# EAGLE design main-board (EAGLE 6.6.0)
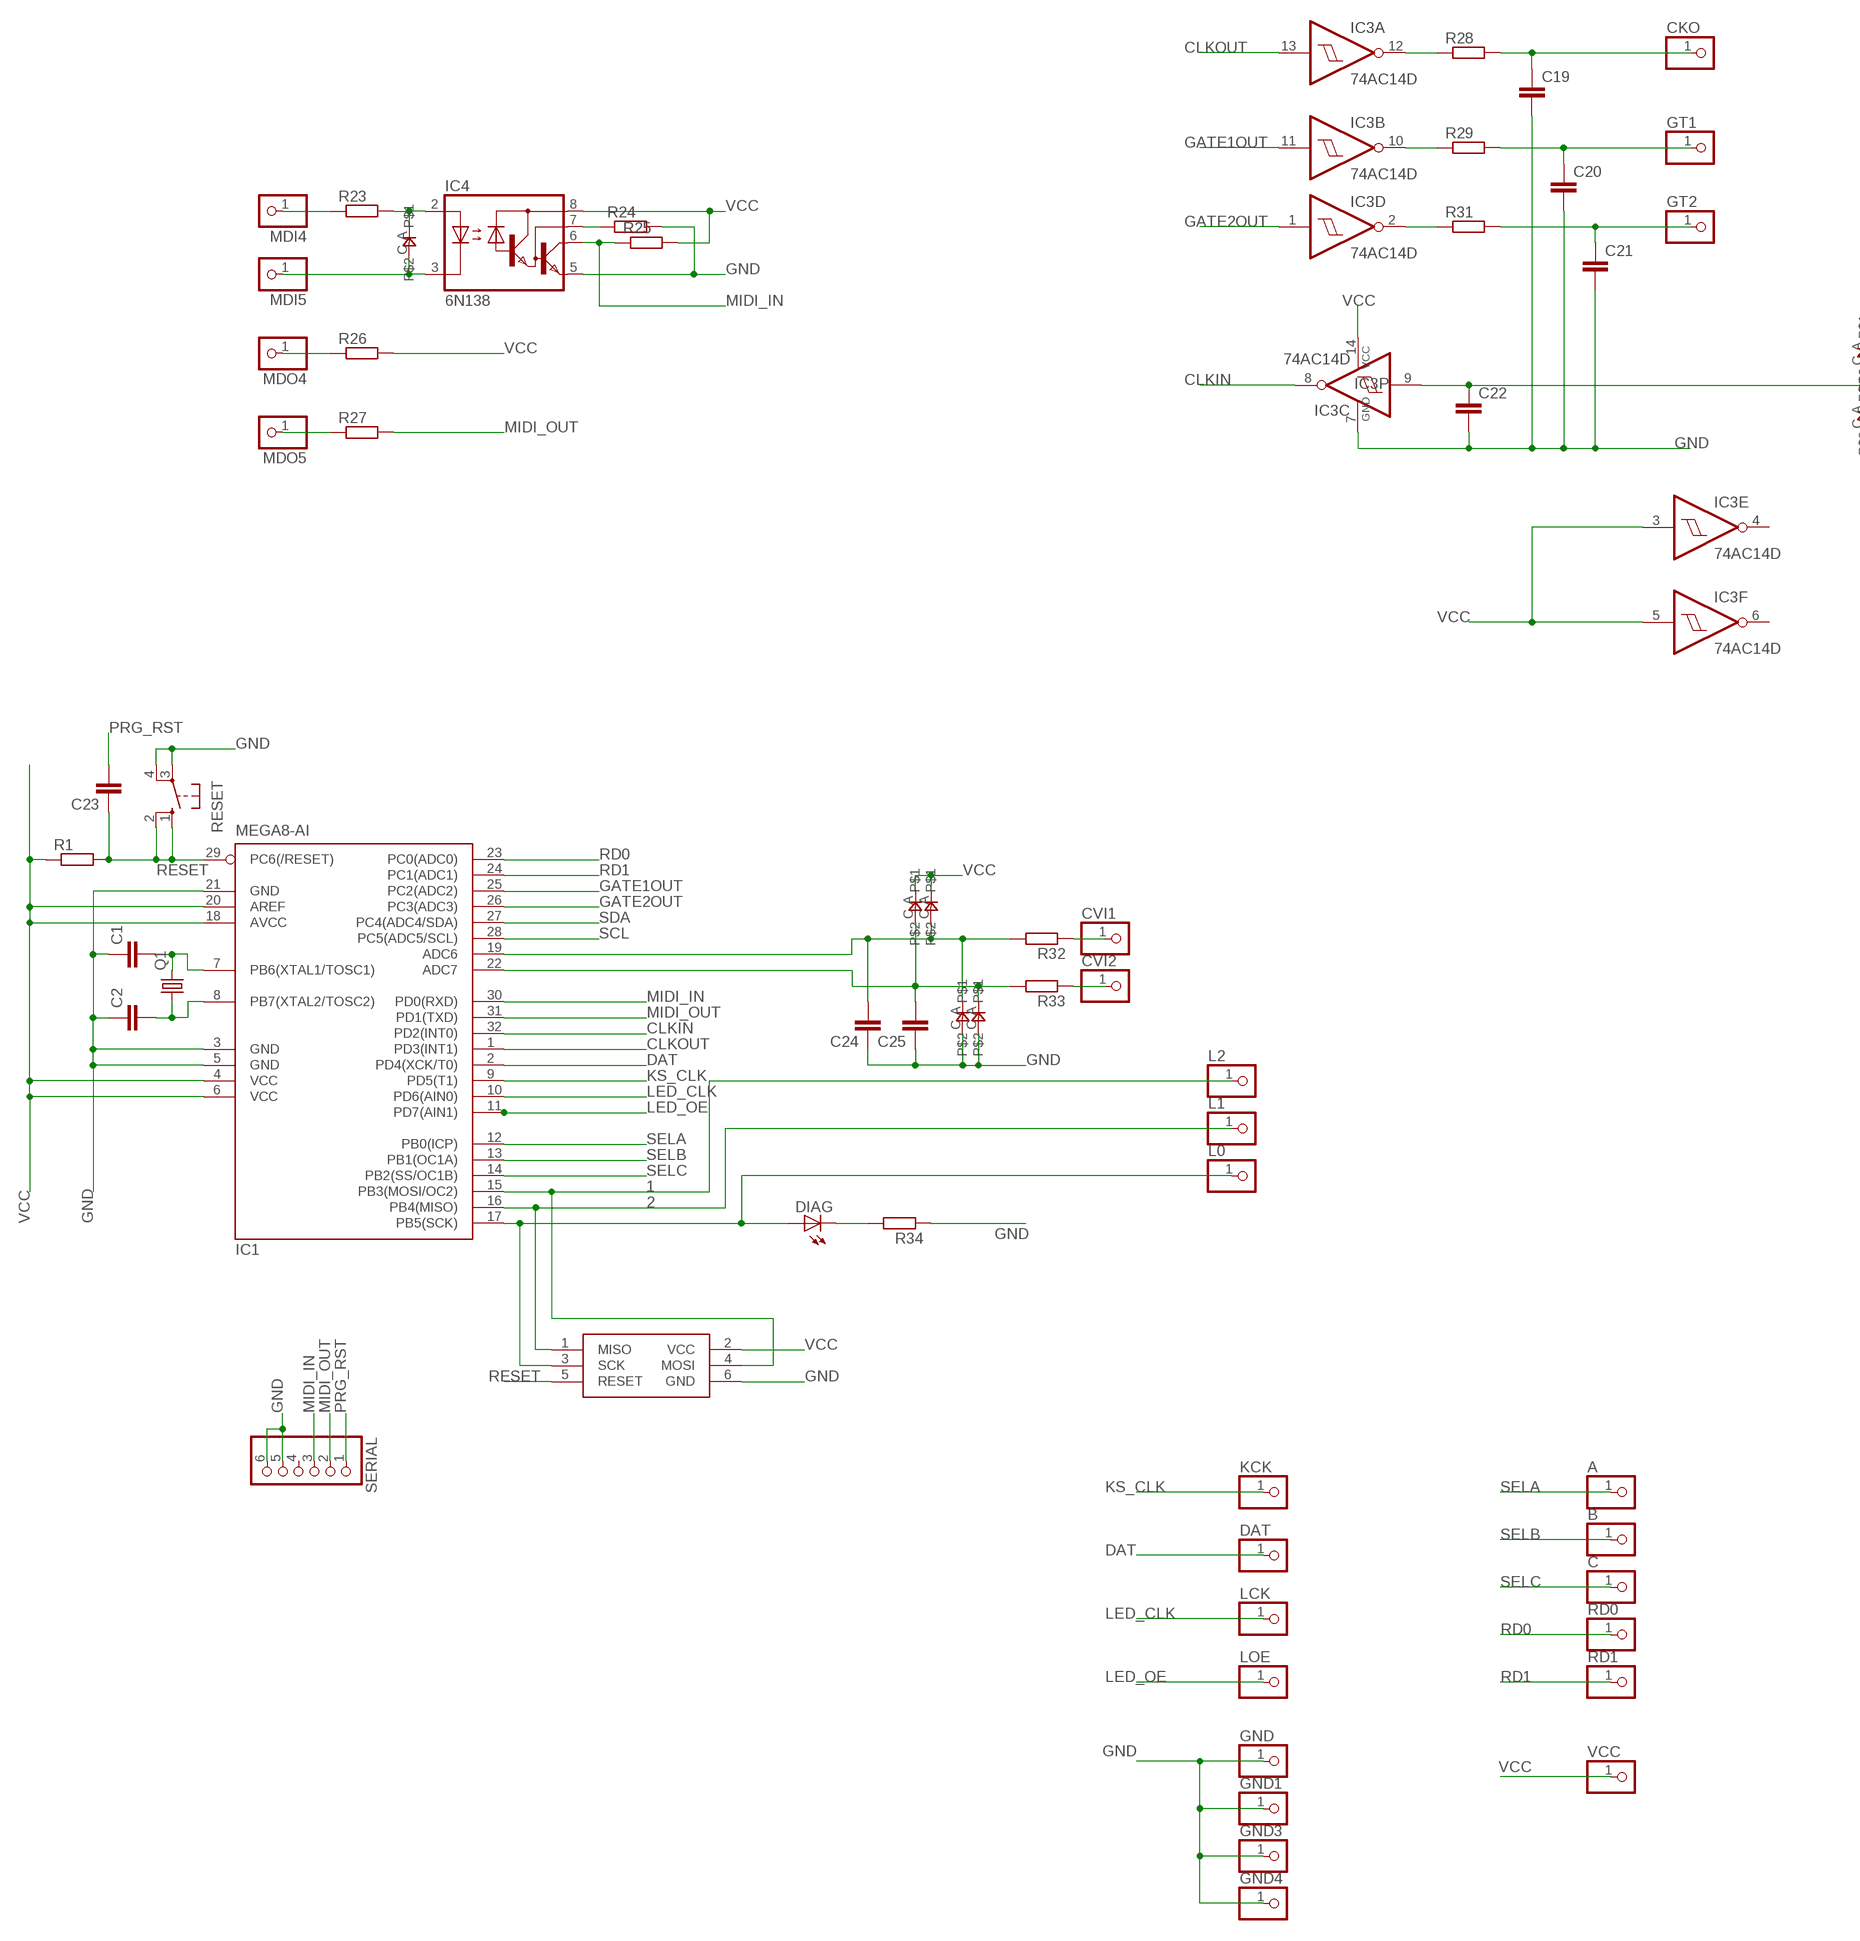
[diagram p0: schematic, sheet 1, part 1 of 2]
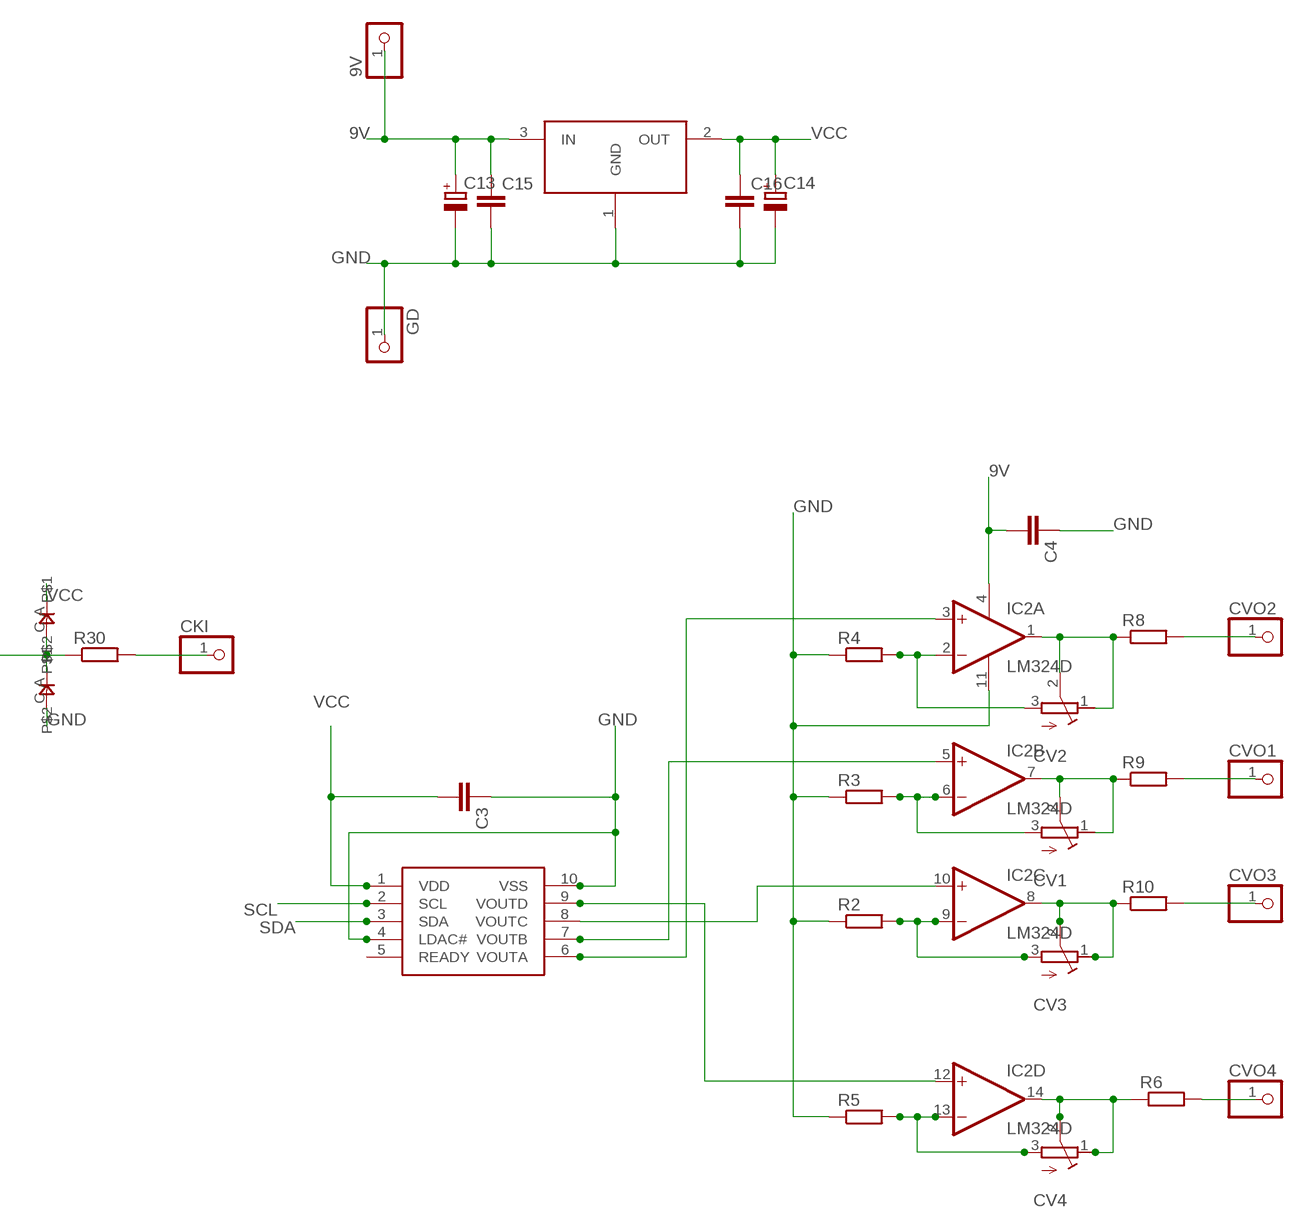
[diagram p1: schematic, sheet 1, part 2 of 2]

## Parts
9V  PINHD-1X1  [1X01]
A  PINHD-1X1  [1X01]
B  PINHD-1X1  [1X01]
C  PINHD-1X1  [1X01]
C1  C-EUC0805  [C0805]
C2  C-EUC0805  [C0805]
C3  C-EUC0805  [C0805]
C4  C-EUC0805  [C0805]
C13  CPOL-EUE2-5  [E2-5]
C14  CPOL-EUE2-5  [E2-5]
C15  C-EUC0805  [C0805]
C16  C-EUC0805  [C0805]
C19  C-EUC0805  [C0805]
C20  C-EUC0805  [C0805]
C21  C-EUC0805  [C0805]
C22  C-EUC0805  [C0805]
C23  C-EUC0805  [C0805]
C24  C-EUC0805  [C0805]
C25  C-EUC0805  [C0805]
CKI  PINHD-1X1  [1X01]
CKO  PINHD-1X1  [1X01]
CV1  R-TRIMM3006P  [RTRIM3006P]
CV2  R-TRIMM3006P  [RTRIM3006P]
CV3  R-TRIMM3006P  [RTRIM3006P]
CV4  R-TRIMM3006P  [RTRIM3006P]
CVI1  PINHD-1X1  [1X01]
CVI2  PINHD-1X1  [1X01]
CVO1  PINHD-1X1  [1X01]
CVO2  PINHD-1X1  [1X01]
CVO3  PINHD-1X1  [1X01]
CVO4  PINHD-1X1  [1X01]
D1  0805DIODE  [0805DIODE]
D2  0805DIODE  [0805DIODE]
D3  0805DIODE  [0805DIODE]
D4  0805DIODE  [0805DIODE]
D5  0805DIODE  [0805DIODE]
D6  0805DIODE  [0805DIODE]
D7  0805DIODE  [0805DIODE]
DAT  PINHD-1X1  [1X01]
DIAG  LED3MM  [LED3MM]
GD  PINHD-1X1  [1X01]
GND  PINHD-1X1  [1X01]
GND1  PINHD-1X1  [1X01]
GND3  PINHD-1X1  [1X01]
GND4  PINHD-1X1  [1X01]
GT1  PINHD-1X1  [1X01]
GT2  PINHD-1X1  [1X01]
IC1  MEGA8-AI  [TQFP32-08]
IC2  LM324D  [SO14]
IC3  74AC14D  [SO14]
IC4  6N138  [DIL08]
IC5  MCP4728_QUAD_DAC  [MSOP10]
ICSP  TAG_CONN_AVR  [TC2030-MCP-NL]
KCK  PINHD-1X1  [1X01]
L0  PINHD-1X1  [1X01]
L1  PINHD-1X1  [1X01]
L2  PINHD-1X1  [1X01]
LCK  PINHD-1X1  [1X01]
LOE  PINHD-1X1  [1X01]
MDI4  PINHD-1X1  [1X01]
MDI5  PINHD-1X1  [1X01]
MDO4  PINHD-1X1  [1X01]
MDO5  PINHD-1X1  [1X01]
Q1  CRYSTALHC49S  [HC49/S]
R1  R-EU_R0805  [R0805]
R2  R-EU_R0805  [R0805]
R3  R-EU_R0805  [R0805]
R4  R-EU_R0805  [R0805]
R5  R-EU_R0805  [R0805]
R6  R-EU_R0805  [R0805]
R8  R-EU_R0805  [R0805]
R9  R-EU_R0805  [R0805]
R10  R-EU_R0805  [R0805]
R23  R-EU_R0805  [R0805]
R24  R-EU_R0805  [R0805]
R25  R-EU_R0805  [R0805]
R26  R-EU_R0805  [R0805]
R27  R-EU_R0805  [R0805]
R28  R-EU_R0805  [R0805]
R29  R-EU_R0805  [R0805]
R30  R-EU_R0805  [R0805]
R31  R-EU_R0805  [R0805]
R32  R-EU_R0805  [R0805]
R33  R-EU_R0805  [R0805]
R34  R-EU_R0805  [R0805]
RD0  PINHD-1X1  [1X01]
RD1  PINHD-1X1  [1X01]
REG1  LD1086  [DPACK]
RESET  10-XX  [B3F-10XX]
SERIAL  PINHD-1X6  [1X06]
VCC  PINHD-1X1  [1X01]

## Nets
1: IC1.15(PB3(MOSI/OC2)) ICSP.4(MOSI) L2.1
2: IC1.16(PB4(MISO)) ICSP.1(MISO) L1.1
3: DIAG.A IC1.17(PB5(SCK)) ICSP.3(SCK) L0.1
9V: 9V.1 C4.2 C13.+ C15.1 IC2.4(P:V+) REG1.3(IN)
CLKIN: IC1.32(PD2(INT0)) IC3.8(C:O)
CLKOUT: IC1.1(PD3(INT1)) IC3.13(A:I)
CV1: CVO2.1 R8.2
DAT: DAT.1 IC1.2(PD4(XCK/T0))
GATE1OUT: IC1.25(PC2(ADC2)) IC3.11(B:I)
GATE2OUT: IC1.26(PC3(ADC3)) IC3.1(D:I)
GND: C1.1 C2.1 C3.1 C4.1 C13.- C14.- C15.2 C16.2 C19.2 C20.2 C21.2 C22.2 C24.1 C25.1 D2.C D4.C D6.C GD.1 GND1.1 GND3.1 GND4.1 GND.1 IC1.3(GND) IC1.5(GND) IC1.21(GND) IC2.11(P:V-) IC3.7(P:GND) IC4.5(GND) IC5.4(LDAC#) IC5.10(VSS) ICSP.6(GND) R2.1 R3.1 R4.1 R5.1 R24.2 R34.1 REG1.1(GND) RESET.3(P) RESET.4(P1) SERIAL.5 SERIAL.6
KS_CLK: IC1.9(PD5(T1)) KCK.1
LED_CLK: IC1.10(PD6(AIN0)) LCK.1
LED_OE: IC1.11(PD7(AIN1)) LOE.1
MIDI_IN: IC1.30(PD0(RXD)) IC4.6(VO) R25.1 SERIAL.3
MIDI_OUT: IC1.31(PD1(TXD)) R27.2 SERIAL.2
N$1: C2.2 IC1.8(PB7(XTAL2/TOSC2)) Q1.1
N$2: C1.2 IC1.7(PB6(XTAL1/TOSC1)) Q1.2
N$3: C24.2 D2.A D3.C IC1.19(ADC6) R32.2
N$4: C25.2 D4.A D5.C IC1.22(ADC7) R33.2
N$5: CV3.1(A) CV3.2(S) IC2.8(C:OUT) R10.1
N$6: CV2.3(E) IC2.2(A:-IN) R4.2
N$7: CV3.3(E) IC2.9(C:-IN) R2.2
N$8: CV4.1(A) CV4.2(S) IC2.14(D:OUT) R6.1
N$9: CVO4.1 R6.2
N$10: CV1.3(E) IC2.6(B:-IN) R3.2
N$11: CV2.1(A) CV2.2(S) IC2.1(A:OUT) R8.1
N$12: CV1.1(A) CV1.2(S) IC2.7(B:OUT) R9.1
N$13: IC2.10(C:+IN) IC5.8(VOUTC)
N$15: IC2.5(B:+IN) IC5.7(VOUTB)
N$16: CV4.3(E) IC2.13(D:-IN) R5.2
N$18: IC2.12(D:+IN) IC5.9(VOUTD)
N$19: IC2.3(A:+IN) IC5.6(VOUTA)
N$39: D1.C IC4.3(C) MDI5.1
N$54: D1.A IC4.2(A) R23.2
N$56: MDI4.1 R23.1
N$57: IC4.7(VB) R24.1
N$58: MDO4.1 R26.1
N$59: MDO5.1 R27.1
N$60: C22.1 D6.A D7.C IC3.9(C:I) R30.1
N$61: IC3.10(B:O) R29.1
N$62: IC3.12(A:O) R28.1
N$63: C19.1 CKO.1 R28.2
N$64: C20.1 GT1.1 R29.2
N$65: CKI.1 R30.2
N$66: IC3.2(D:O) R31.1
N$67: C21.1 GT2.1 R31.2
N$68: CVI1.1 R32.1
N$69: CVI2.1 R33.1
N$71: DIAG.K(C) R34.2
N$72: CVO3.1 R10.2
N$73: CVO1.1 R9.2
PRG_RST: C23.2 SERIAL.1
RD0: IC1.23(PC0(ADC0)) RD0.1
RD1: IC1.24(PC1(ADC1)) RD1.1
RESET: C23.1 IC1.29(PC6(/RESET)) ICSP.5(RESET) R1.2 RESET.1(S) RESET.2(S1)
SCL: IC1.28(PC5(ADC5/SCL)) IC5.2(SCL)
SDA: IC1.27(PC4(ADC4/SDA)) IC5.3(SDA)
SELA: A.1 IC1.12(PB0(ICP))
SELB: B.1 IC1.13(PB1(OC1A))
SELC: C.1 IC1.14(PB2(SS/OC1B))
VCC: C3.2 C14.+ C16.1 D3.A D5.A D7.A IC1.4(VCC) IC1.6(VCC) IC1.18(AVCC) IC1.20(AREF) IC3.3(E:I) IC3.5(F:I) IC3.14(P:VCC) IC4.8(VCC) IC5.1(VDD) ICSP.2(VCC) R1.1 R25.2 R26.2 REG1.2(OUT) VCC.1
Unconnected: IC3.4(E:O) IC3.6(F:O) IC5.5(READY) SERIAL.4

## Library data of the parts
9V A B C CKI CKO CVI1 CVI2 CVO1-CVO4 DAT GD GND GND1 GND3 GND4 GT1 GT2 KCK L0 L1 L2 LCK LOE MDI4 MDI5 MDO4 MDO5 RD0 RD1 VCC = pinhead:PINHD-1X1: PIN HEADER
C1-C4 C15 C16 C19-C25 = rcl:C-EU: CAPACITOR, European symbol
C13 C14 = rcl:CPOL-EU: POLARIZED CAPACITOR, European symbol
CV1-CV4 = resistor:R-TRIMM: Trimm resistor
D1-D7 = jasons_stuff:0805DIODE
DIAG = led:LED: LED OSRAM: - CHIPLED LG R971, LG N971, LY N971, LG Q971, LY Q971, LO R971, LY R971 LH N974, LH R974 LS Q976, LO Q976, LY Q976 LO Q996 - Hyper CHIPLED LW Q18S LB Q993, LB Q99A, LB R99A - SideLED LS A670, LO A670, LY A670, LG A670, LP A670 LB A673, LV A673, LT A673, LW A673 LH A674 LY A675 LS A676, LA A676, LO A676, LY A676, LW A676 LS A679, LY A679, LG A679 - Hyper Micro SIDELED® LS Y876, LA Y876, LO Y876, LY Y876 LT Y87S - SmartLED LW L88C, LW L88S LB L89C, LB L89S, LG L890 LS L89K, LO L89K, LY L89K LS L896, LA L896, LO L896, LY L896 - TOPLED LS T670, LO T670, LY T670, LG T670, LP T670 LSG T670, LSP T670, LSY T670, LOP T670, LYG T670 LG T671, LOG T671, LSG T671 LB T673, LV T673, LT T673, LW T673 LH T674 LS T676, LA T676, LO T676, LY T676, LB T676, LH T676, LSB T676, LW T676 LB T67C, LV T67C, LT T67C, LS T67K, LO T67K, LY T67K, LW E67C LS E67B, LA E67B, LO E67B, LY E67B, LB E67C, LV E67C, LT E67C LW T67C LS T679, LY T679, LG T679 LS T770, LO T770, LY T770, LG T770, LP T770 LB T773, LV T773, LT T773, LW T773 LH T774 LS E675, LA E675, LY E675, LS T675 LS T776, LA T776, LO T776, LY T776, LB T776 LHGB T686 LT T68C, LB T68C - Hyper Mini TOPLED® LB M676 - Mini TOPLED Santana® LG M470 LS M47K, LO M47K, LY M47K Source: http://www.osram.convergy.de LUXEON: - LUMILED® LXK2-PW12-R00, LXK2-PW12-S00, LXK2-PW14-U00, LXK2-PW14-V00 LXK2-PM12-R00, LXK2-PM12-S00, LXK2-PM14-U00 LXK2-PE12-Q00, LXK2-PE12-R00, LXK2-PE12-S00, LXK2-PE14-T00, LXK2-PE14-U00 LXK2-PB12-K00, LXK2-PB12-L00, LXK2-PB12-M00, LXK2-PB14-N00, LXK2-PB14-P00, LXK2-PB14-Q00 LXK2-PR12-L00, LXK2-PR12-M00, LXK2-PR14-Q00, LXK2-PR14-R00 LXK2-PD12-Q00, LXK2-PD12-R00, LXK2-PD12-S00 LXK2-PH12-R00, LXK2-PH12-S00 LXK2-PL12-P00, LXK2-PL12-Q00, LXK2-PL12-R00 Source: www.luxeon.com KINGBRIGHT: KA-3528ASYC Source: www.kingbright.com
IC1 = atmel:MEGA8: MICROCONTROLLER 8 Kbytes FLASH, 1 kbytes SRAM, 512 bytes EEPROM, USART, 6-channel 10 bit ADC, 2-channel 8 bit ADC Pin compatible with Atmega48, ATMega88, ATMega168 Source: avr.lbr; MPN: ATMEGA8-16AU; OC_FARNELL: 9171371; OC_NEWARK: 73M8863
IC2 = linear:LM324: OP AMP
IC3 = 74xx-eu:74*14: Hex schmitt trigger INVERTER
IC4 = optocoupler:6N138: MOTOROLA OPTO COUPLER; MF: VISHAY/TELEFUNKEN; MPN: 6N138; OC_FARNELL: 9860150; OC_NEWARK: 35K5294
IC5 = jason_eagle6:MCP4728_QUAD_DAC
ICSP = jasons_stuff:TAG_CONN_AVR
Q1 = crystal:CRYSTAL: CRYSTAL; OC_FARNELL: 1667008; OC_NEWARK: unknown
R1-R6 R8-R10 R23-R34 = rcl:R-EU_: RESISTOR, European symbol
REG1 = jason_eagle6:LD1086
RESET = switch-omron:10-XX: OMRON SWITCH; MPN: B3F-1000; OC_FARNELL: 176432; OC_NEWARK: 36M3542
SERIAL = pinhead:PINHD-1X6: PIN HEADER

## Board
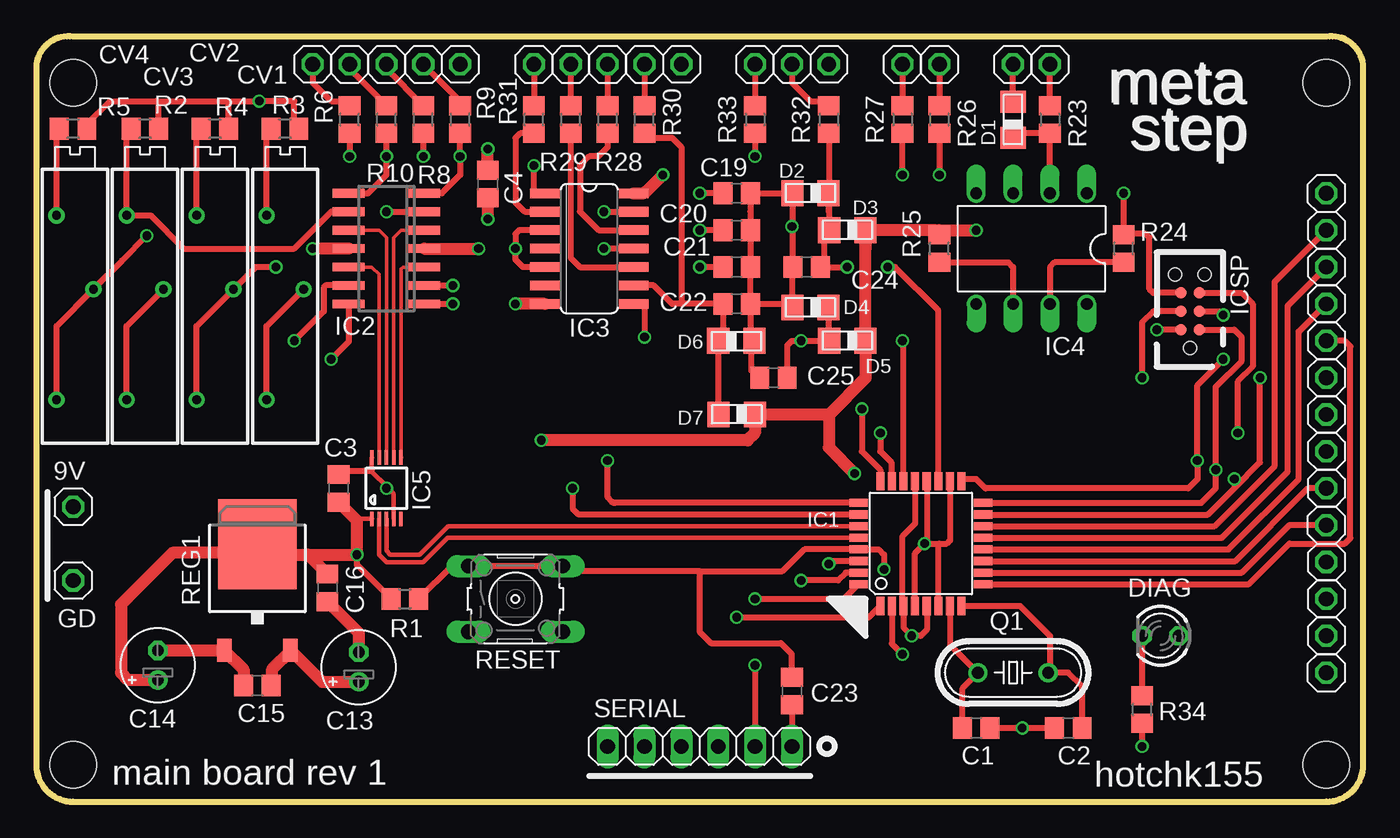
[diagram p2: board, top side]
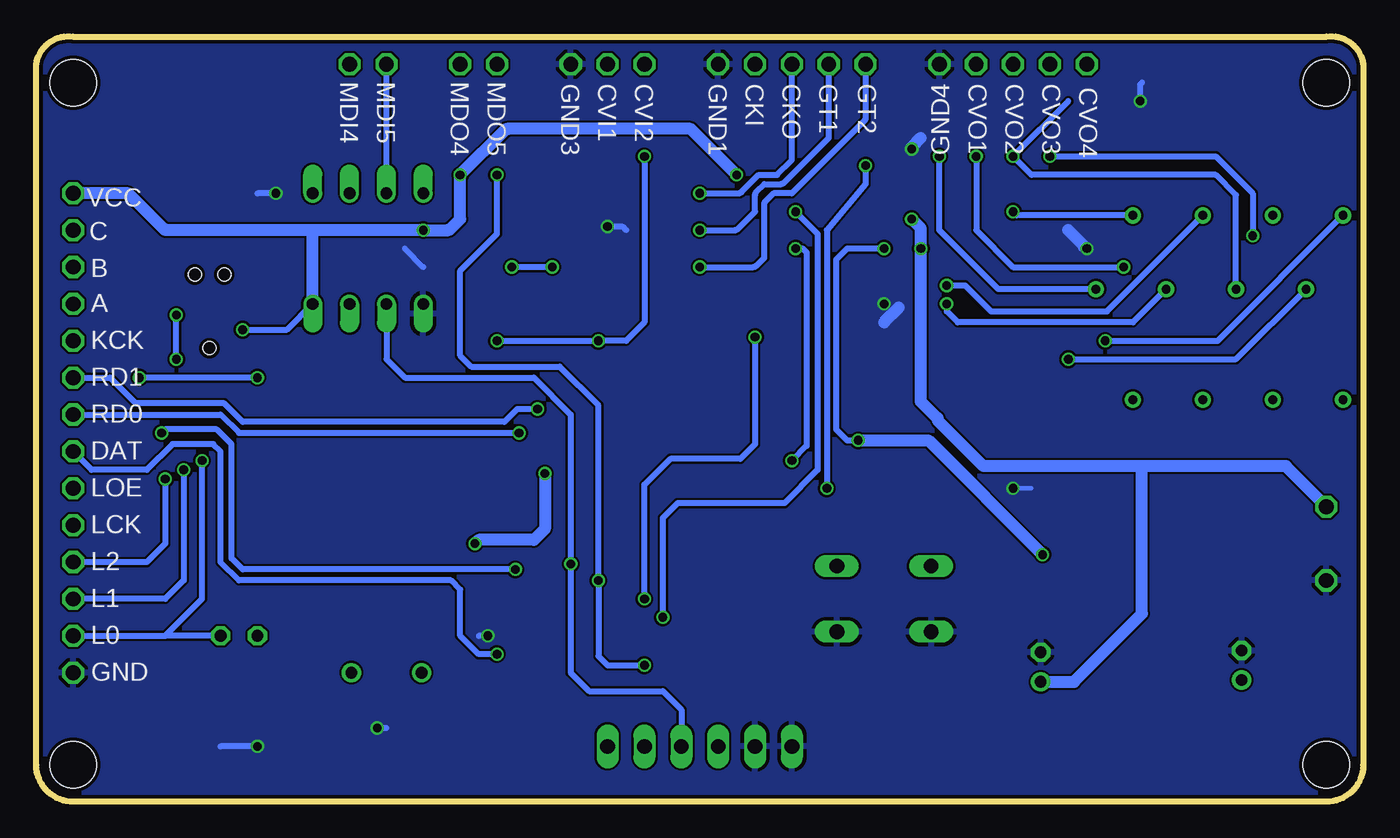
[diagram p3: board, bottom side, seen from below]

Size 91.44 x 52.73 mm. Coordinates in mm from the lower left corner, seen from the top.
Outline: 0,50.8 0,2.54 arc90 2.54,0 88.9,0 arc90 91.44,2.54 91.44,50.8 arc90 88.9,52.7 2.54,52.7 arc90 0,50.8
Copper layers (1*16): Top 0.035mm / dielectric 1.5mm / Bottom 0.035mm
Design rules "ITEADstudio_DRC": minimum track width 6mil, minimum drill 12mil, track to track 6mil, track to pad 6mil, pad to pad 6mil, via to via 6mil, smd to smd 0mil, copper to edge 10mil, drill to drill 10mil, minimum pad ring 10mil, minimum via ring 6mil, stop-mask expansion 2mil, vias tented up to drill 100mil, thermal gap 10mil
Holes 3.2 mm at 2.54,2.54 2.54,49.53 88.9,49.53 88.9,2.54

### Footprints (pad centres in the part's own frame; a part is rotated, then mirrored left to right if it is on the bottom)
1X01 = drill 1.016 octagon: 1 0,0
C0805 = smd 1.3 x 1.5: 1 -0.95,0; 2 0.95,0
E2-5 = drill 0.813 pad 1.27: + -1.016,0 | drill 0.813 pad 1.27 octagon: - 1.016,0
RTRIM3006P = drill 0.61: 1 -7.62,1.27; 2 0,-1.27; 3 5.08,1.27
0805DIODE = smd 1.524 x 1.778: A -1.262,-0.005; C 1.238,-0.005
LED3MM = drill 0.813 octagon: A -1.27,0; K 1.27,0
TQFP32-08 = smd 1.27 x 0.559: 1 -4.293,2.8; 2 -4.293,2; 3 -4.293,1.2; 4 -4.293,0.4; 5 -4.293,-0.4; 6 -4.293,-1.2; 7 -4.293,-2; 8 -4.293,-2.8; 17 4.293,-2.8; 18 4.293,-2; 19 4.293,-1.2; 20 4.293,-0.4; 21 4.293,0.4; 22 4.293,1.2; 23 4.293,2; 24 4.293,2.8 | smd 0.559 x 1.27: 9 -2.8,-4.293; 10 -2,-4.293; 11 -1.2,-4.293; 12 -0.4,-4.293; 13 0.4,-4.293; 14 1.2,-4.293; 15 2,-4.293; 16 2.8,-4.293; 25 2.8,4.293; 26 2,4.293; 27 1.2,4.293; 28 0.4,4.293; 29 -0.4,4.293; 30 -1.2,4.293; 31 -2,4.293; 32 -2.8,4.293
SO14 = smd 0.6 x 2.2: 1 -3.81,-2.6; 2 -2.54,-2.6; 3 -1.27,-2.6; 4 0,-2.6; 5 1.27,-2.6; 6 2.54,-2.6; 7 3.81,-2.6; 8 3.81,2.6; 9 2.54,2.6; 10 1.27,2.6; 11 0,2.6; 12 -1.27,2.6; 13 -2.54,2.6; 14 -3.81,2.6
SO14' = smd 0.66 x 2.032: 1 -3.81,-3.073; 2 -2.54,-3.073; 3 -1.27,-3.073; 4 0,-3.073; 5 1.27,-3.073; 6 2.54,-3.073; 7 3.81,-3.073; 8 3.81,3.073; 9 2.54,3.073; 10 1.27,3.073; 11 0,3.073; 12 -1.27,3.073; 13 -2.54,3.073; 14 -3.81,3.073
DIL08 = drill 0.813 offset: 1 -3.81,-3.81; 2 -1.27,-3.81; 3 1.27,-3.81; 4 3.81,-3.81; 5 3.81,3.81; 6 1.27,3.81; 7 -1.27,3.81; 8 -3.81,3.81
MSOP10 = smd 0.25 x 1: 1 -1,-2.113; 2 -0.5,-2.113; 3 0,-2.113; 4 0.5,-2.113; 5 1,-2.113; 6 1,2.113; 7 0.5,2.113; 8 0,2.113; 9 -0.5,2.113; 10 -1,2.113
TC2030-MCP-NL = smd 0.787 x 0.787: 1 1.27,-0.635; 2 1.27,0.635; 3 2.54,-0.635; 4 2.54,0.635; 5 3.81,-0.635; 6 3.81,0.635 | hole 0.889: 0,0; 5.08,-1.016; 5.08,1.016
HC49/S = drill 0.813: 1 -2.413,0; 2 2.413,0
R0805 = smd 1.3 x 1.5: 1 -0.95,0; 2 0.95,0
DPACK = smd 1 x 1.6: 1 -2.28,-4.8; 3 2.28,-4.8 | smd 5.4 x 6.2: 2 0,2.5
B3F-10XX = drill 1.016 long: 1 -3.251,2.261; 2 3.251,2.261; 3 -3.251,-2.261; 4 3.251,-2.261
1X06 = drill 1.016 long: 1 -6.35,0; 2 -3.81,0; 3 -1.27,0; 4 1.27,0; 5 3.81,0; 6 6.35,0

### Placement (x,y rotation side)
9V  2.54,20.32 0 top
A  88.9,34.29 0 top
B  88.9,36.83 0 top
C  88.9,39.37 0 top
C1  64.77,5.08 180 top
C2  71.12,5.08 0 top
C3  20.83,21.59 270 top
C4  31.11,42.55 270 top
C13  22.22,9.27 90 top
C14  8.38,9.4 90 top
C15  15.24,8 180 top
C16  20.07,14.73 270 top
C19  48.26,41.91 0 top
C20  48.26,39.37 0 top
C21  48.26,36.83 0 top
C22  48.26,34.29 0 top
C23  52.07,7.62 270 top
C24  53.09,36.83 0 top
C25  50.8,29.21 0 top
CKI  41.91,50.8 90 top
CKO  39.37,50.8 90 top
CV1  17.14,35.31 90 top
CV2  12.32,35.31 90 top
CV3  7.49,35.31 90 top
CV4  2.67,35.31 90 top
CVI1  52.07,50.8 90 top
CVI2  49.53,50.8 90 top
CVO1  26.67,50.8 90 top
CVO2  24.13,50.8 90 top
CVO3  21.59,50.8 90 top
CVO4  19.05,50.8 0 top
D1  67.31,46.99 90 top
D2  53.34,41.91 180 top
D3  55.88,39.37 180 top
D4  53.34,34.04 180 top
D5  55.88,31.75 180 top
D6  48.26,31.75 0 top
D7  48.26,26.67 180 top
DAT  88.9,24.13 0 top
DIAG  77.47,11.43 180 top
GD  2.54,15.24 0 top
GND  88.9,8.89 90 top
GND1  44.45,50.8 0 top
GND3  54.61,50.8 0 top
GND4  29.21,50.8 0 top
GT1  36.83,50.8 90 top
GT2  34.29,50.8 90 top
IC1  60.96,17.78 90 top
IC2  24.13,38.1 90 top
IC3  74AC14D  [SO14']  38.1,38.1 270 top
IC4  68.58,38.1 180 top
IC5  24.13,21.59 0 top
ICSP  79.5,31.24 90 top
KCK  88.9,31.75 0 top
L0  88.9,11.43 0 top
L1  88.9,13.97 0 top
L2  88.9,16.51 0 top
LCK  88.9,19.05 90 top
LOE  88.9,21.59 0 top
MDI4  69.85,50.8 90 top
MDI5  67.31,50.8 90 top
MDO4  62.23,50.8 90 top
MDO5  59.69,50.8 90 top
Q1  67.31,8.89 180 top
R1  25.4,13.97 0 top
R2  7.49,46.36 180 top
R3  17.14,46.36 180 top
R4  12.32,46.36 180 top
R5  2.54,46.36 180 top
R6  21.59,46.99 90 top
R8  26.67,46.99 90 top
R9  29.21,46.99 90 top
R10  24.13,46.99 90 top
R23  69.85,46.99 270 top
R24  74.93,38.1 90 top
R25  62.23,38.1 90 top
R26  62.23,46.99 270 top
R27  59.69,46.99 270 top
R28  39.37,46.99 90 top
R29  36.83,46.99 90 top
R30  41.91,46.99 90 top
R31  34.29,46.99 90 top
R32  54.61,46.99 270 top
R33  49.53,46.99 270 top
R34  76.2,6.35 90 top
RD0  88.9,26.67 0 top
RD1  88.9,29.21 0 top
REG1  15.24,15.24 0 top
RESET  33.02,13.97 0 top
SERIAL  45.72,3.81 180 top
VCC  88.9,41.91 90 top

### Tracks (layer width: path | path; a pad name or v marks a point on that pad's centre or on a via)
1  (via drill 0.6)
  Top 0.406: IC1.15 80.74,19.78 82.55,21.59 | v82.55,22.23 82.55,21.59 | 82.55,21.59 84.33,23.37 v84.33,29.21 | ICSP.4 76.96,33.78 76.2,33.02 v76.2,29.21
  Bottom 0.406: v82.55,22.23 82.55,17.78 83.82,16.51 L2.1 | v76.2,29.21 v84.33,29.21
2  (via drill 0.6)
  Top 0.406: IC1.16 80.27,20.58 81.28,21.59 v81.28,22.86 81.28,28.57 83.06,30.35 83.06,32 82.55,32.51 ICSP.1
  Bottom 0.406: v81.28,22.86 81.28,15.24 82.55,13.97 L1.1
3  (via drill 0.6)
  Top 0.406: IC1.17 63.91,22.23 64.77,22.23 65.41,21.59 79.38,21.59 80.01,22.23 v80.01,23.5 80.01,28.7 v81.79,30.48 | ICSP.3 81.53,33.78 v81.79,33.53
  Bottom 0.406: L0.1 82.55,11.43 | 82.55,11.43 80.01,13.97 v80.01,23.5 | v81.79,30.48 v81.79,33.53 | DIAG.A 82.55,11.43
9V  (via drill 0.6)
  Top 0.813: C15.1 16.26,8.07 16.26,9.14 17.52,10.41 REG1.3 19.7,8.25 C13.+ | C4.2 v31.11,40.13 | IC2.4 v30.48,38.1
  Bottom 0.813: 15.24,23.11 5.33,23.11 9V.1 | 15.24,23.11 26.16,23.11 29.34,26.29 29.34,26.42 30.48,27.56 30.48,36.7 v30.48,38.1 30.48,39.5 v31.11,40.13 | C13.+ 19.94,8.25 15.24,12.95 15.24,23.11
CLKIN  (via drill 0.6)
  Top 0.406: 41.18,34.28 IC3.8 41.91,34.29 v41.91,32 | v49.53,13.97 55.66,13.97 IC1.32
  Bottom 0.406: v49.53,13.97 49.53,21.84 47.75,23.62 42.93,23.62 41.91,24.64 v41.91,32
CLKOUT  (via drill 0.6)
  Top 0.406: v39.12,40.64 IC3.13 | v48.26,12.7 57.37,12.7 IC1.1
  Bottom 0.406: v48.26,12.7 48.26,19.56 47.24,20.57 39.88,20.57 37.59,22.86 37.59,39.12 v39.12,40.64
CV1
  Top 0.406: CVO2.1 24.13,50.48 R8.2
DAT  (via drill 0.6)
  Top 0.406: IC1.2 58.96,10.89 v59.69,10.16
  Bottom 0.406: v59.69,10.16 60.96,10.16 62.23,11.43 62.23,14.61 62.87,15.24 77.47,15.24 78.74,16.51 78.74,24.13 79.25,24.64 82.04,24.64 83.82,22.86 87.63,22.86 DAT.1
GATE1OUT  (via drill 0.6)
  Top 0.406: IC3.11 v39.12,38.1 | IC1.25 39.88,20.58 arc-45 39.65,20.67 39.37,20.96 v39.37,23.5
  Bottom 0.406: v39.12,38.1 38.61,38.1 38.35,37.85 38.35,24.51 v39.37,23.5
GATE2OUT  (via drill 0.6)
  Top 0.406: IC1.26 37.37,19.78 36.96,20.19 v36.96,21.59 | IC3.1 34.29,41.91 v34.29,43.81
  Bottom 0.406: v34.29,43.81 34.29,42.55 36.96,39.37 v36.96,21.59
GND  (via drill 0.6, 0.6 pad 0.25)
  Top 0.305: IC5.4 24.64,21.21 24.26,21.59 v24.13,21.59 24.13,21.72 23.11,22.73 23.11,22.86 23.11,23.69 IC5.10
  Top 0.406: C22.2 C21.2 C20.2 49.21,40.64 | 49.21,40.64 C19.2 D2.C | 49.22,40.65 49.21,40.64 | C22.2 52.1,34.29 D4.C 52.1,36.54 C24.1 | IC1.5 61.36,11.83 60.96,11.43 v60.33,11.43 59.76,12 IC1.3 59.69,13.56 59.69,18.29 60.56,19.16 IC1.21 | C22.2 49.21,32.03 D6.C 49.28,31.52 49.28,29.72 49.78,29.21 C25.1 | C2.1 v67.95,5.08 C1.1 | v74.93,41.91 R24.2 75,39.12 76.45,39.12 76.71,38.86 76.71,35.31 76.96,35.05 ICSP.6 | D2.C 52.1,36.86 52.07,36.83 | D2.C 52.1,39.66 v52.07,39.62 | R34.1 v76.2,3.81 | C3.1 21.08,22.79 23.05,22.79 23.11,22.86 | R5.1 3.49,46.67 5.08,48.26 8.25,48.26 | 8.25,48.26 13.08,48.26 | 13.08,48.26 v15.37,48.26 17.78,48.26 17.78,46.86 | 17.78,46.86 17.78,46.67 R3.1 18.09,46.55 17.78,46.86 | R4.1 13.27,48.07 13.08,48.26 | R2.1 8.44,48.07 8.25,48.26
  Top 0.813: IC3.7 v33.02,34.29 | C14.- 8.41,10.44 REG1.1 | REG1.1 | C16.2 22.22,11.62 C13.- | REG1.1 14.29,9.11 C15.2 | C4.1 v31.11,44.96 | IC2.11 v19.05,38.1
  Bottom 0.305: v24.13,21.59 22.86,21.59
  Bottom 0.406: 66.04,38.1 64.77,36.83 | v60.33,11.43 60.96,11.43 | v67.95,5.08 67.31,5.08 | v74.93,41.91 76.2,41.91 | v52.07,39.62 51.05,39.62 50.8,39.37 | v76.2,3.81 78.74,3.81 | v15.37,48.26 15.37,49.4 15.24,49.53 | 19.43,38.1 v19.05,38.1
  Bottom 0.813: 32,34.04 33.02,33.02 | v31.11,44.96 31.11,45.09 30.48,45.72 | v19.05,38.1 20.32,39.37
  pour Bottom: -2.54,55.88 -2.54,-5.08 95.25,-5.08 95.25,55.88
KS_CLK
  Top 0.406: IC1.9 83.56,14.98 86.36,17.78 90.17,17.78 90.55,18.16 90.55,31.37 90.17,31.75 KCK.1
LED_CLK
  Top 0.406: IC1.10 83.09,15.78 86.36,19.05 LCK.1
LED_OE
  Top 0.406: IC1.11 82.62,16.58 87.63,21.59 LOE.1
MIDI_IN  (via drill 0.6)
  Top 0.406: R25.1 66.99,37.15 67.31,36.83 IC4.6 | IC1.30 54.81,16.58 v54.61,16.38
  Bottom 0.406: IC4.6 67.31,30.48 66.04,29.21 57.15,29.21 54.61,26.67 v54.61,16.38 54.61,8.89 53.34,7.62 48.26,7.62 46.99,6.35 SERIAL.3
MIDI_OUT  (via drill 0.6)
  Top 0.406: v59.69,43.18 R27.2 | IC1.31 55.78,15.78 55.25,15.24 v52.7,15.24 | v49.53,9.4 SERIAL.2
  Bottom 0.406: v49.53,9.4 52.07,9.4 52.7,10.03 v52.7,15.24 52.7,27.3 55.37,29.97 61.47,29.97 62.23,30.73 62.23,36.58 59.69,39.12 v59.69,43.18
N$1
  Top 0.406: IC1.8 67.79,13.49 69.85,11.43 69.85,9.02 Q1.1 71.12,8.89 72.07,7.94 C2.2
N$2
  Top 0.406: IC1.7 62.96,10.83 Q1.2 63.82,7.81 C1.2
N$3  (via drill 0.6)
  Top 0.406: R32.2 54.61,40.65 | 54.61,40.65 D2.A | 54.61,40.65 54.61,39.41 D3.C 54.29,39.02 54.29,37.15 54.61,36.83 | IC1.19 62.16,33.85 59.18,36.83 v58.67,36.83 | C24.2 54.61,36.83 | 54.61,36.83 v55.88,36.83
  Bottom 0.406: v55.88,36.83 v58.67,36.83
N$4  (via drill 0.6)
  Top 0.406: R33.2 v49.53,44.45 | D4.A 54.6,31.8 D5.C v52.7,31.75 52.07,31.75 51.75,31.43 C25.2 | IC1.22 59.76,31.68 v59.69,31.75
  Bottom 0.406: v49.53,44.45 49.53,33.02 50.8,31.75 v52.7,31.75 v59.69,31.75
N$5  (via drill 0.6)
  Top 0.406: R10.1 v24.13,44.45 24.13,43.18 22.86,41.91 IC2.8 | CV3.1 6.22,32.77 CV3.2
  Bottom 0.406: 20.32,48.26 v24.13,44.45 22.86,43.18 10.16,43.18 8.76,41.78 CV3.2
N$6  (via drill 0.6)
  Top 0.406: CV2.3 11.05,46.04 R4.2 | IC2.2 v28.7,35.56
  Bottom 0.406: v28.7,35.56 27.43,35.56 25.65,33.78 17.65,33.78 CV2.3
N$7
  Top 0.406: R2.2 6.22,46.04 CV3.3 7.87,40.39 10.16,38.1 17.78,38.1 20.32,40.64 IC2.9
N$8  (via drill 0.6)
  Top 0.406: CV4.1 1.4,32.77 CV4.2 5.91,37.27 v7.62,38.99 | IC2.14 21.53,31.69 v20.32,30.48 | R6.1 v21.59,44.45
  Bottom 0.406: v20.32,30.48 8.76,30.48 CV4.2 | v21.59,44.45 10.16,44.45 7.62,41.91 v7.62,38.99
N$9
  Top 0.406: CVO4.1 19.05,49.53 20.32,48.26 21.27,48.26 R6.2
N$10  (via drill 0.6)
  Top 0.406: CV1.3 15.88,46.04 R3.2 | v24.13,40.64 IC2.6
  Bottom 0.406: CV1.3 23.88,40.39 v24.13,40.64
N$11  (via drill 0.6)
  Top 0.406: R8.1 v26.67,44.45 | CV2.1 11.05,32.77 CV2.2 15.11,36.83 v16.51,36.83 | IC2.1 v28.7,34.29
  Bottom 0.406: v28.7,34.29 28.7,33.78 27.94,33.02 15.88,33.02 CV2.2 | v26.67,44.45 26.67,39.37 24.13,36.83 v16.51,36.83
N$12  (via drill 0.6)
  Top 0.406: IC2.7 27.94,41.91 29.21,43.18 v29.21,44.45 R9.1 | CV1.1 15.88,32.77 CV1.2
  Bottom 0.406: v29.21,44.45 29.21,39.37 25.15,35.31 CV1.2
N$13
  Top 0.254: IC5.8 24.13,38.86 23.62,39.37 IC2.10
N$15
  Top 0.254: IC5.7 24.63,38.85 25.15,39.37 IC2.5
N$16  (via drill 0.6)
  Top 0.406: CV4.3 1.4,46.16 R5.2 | IC2.13 19.94,35.56 19.81,35.43 19.81,33.78 v17.78,31.75
  Bottom 0.406: v17.78,31.75 10.03,31.75 CV4.3
N$18
  Top 0.254: IC2.12 23.11,36.83 23.62,36.32 23.62,23.71 IC5.9
N$19
  Top 0.254: 25.15,23.72 25.15,36.7 25.27,36.83 IC2.3
  Top 0.305: 25.15,23.72 IC5.6
N$39
  Top 0.406: D1.C MDI5.1
  Bottom 0.406: IC4.3 MDI5.1
N$54
  Top 0.406: IC4.2 R23.2 67.63,46.04 D1.A
N$56
  Top 0.406: R23.1 MDI4.1
N$57
  Top 0.406: R24.1 70.17,37.15 69.85,36.83 IC4.7
N$58
  Top 0.406: MDO4.1 R26.1
N$59
  Top 0.406: MDO5.1 R27.1
N$60
  Top 0.406: R30.1 41.91,45.72 43.81,45.72 44.45,45.09 44.45,34.29 | IC3.9 42.55,35.56 43.81,34.29 44.45,34.29 | 44.45,34.29 C22.1 47.31,32.06 D6.A 47.02,31.72 D7.C
N$61
  Top 0.406: R29.1 36.83,37.47 37.47,36.83 40,36.83 40.64,36.83 IC3.10
N$62
  Top 0.406: R28.1 39.37,45.09 38.73,44.45 38.1,44.45 37.47,43.81 37.47,40.64 38.73,39.37 IC3.12
N$63  (via drill 0.6)
  Top 0.406: CKO.1 R28.2 | C19.1 v45.72,41.91
  Bottom 0.406: v45.72,41.91 43.06,41.91 arc-45 42.83,42 41.66,43.18 40.39,43.18 39.37,44.2 CKO.1
N$64  (via drill 0.6)
  Top 0.406: GT1.1 R29.2 | C20.1 v45.72,39.37
  Bottom 0.406: v45.72,39.37 43.31,39.37 arc-45 43.09,39.46 41.91,40.64 41.91,41.78 arc45 41.82,42 41.28,42.55 40.14,42.55 arc-45 39.91,42.64 36.83,45.72 GT1.1
N$65
  Top 0.406: CKI.1 R30.2
N$66
  Top 0.406: R31.1 33.34,46.04 33.02,45.72 33.02,41.27 33.66,40.64 IC3.2
N$67  (via drill 0.6)
  Top 0.406: GT2.1 R31.2 | C21.1 v45.72,36.83
  Bottom 0.406: v45.72,36.83 42.04,36.83 arc-45 41.82,36.92 41.28,37.47 41.28,41.14 arc45 41.18,41.37 40.64,41.91 39.37,41.91 34.38,46.9 arc-45 34.29,47.12 GT2.1
N$68
  Top 0.406: CVI1.1 52.07,49.53 53.34,48.26 54.29,48.26 R32.1
N$69
  Top 0.406: CVI2.1 R33.1
N$71
  Top 0.406: DIAG.K R34.2
N$72
  Top 0.406: CVO3.1 21.59,50.48 R10.2
N$73
  Top 0.406: CVO1.1 29.21,48.26 R9.2
PRG_RST
  Top 0.406: C23.2 SERIAL.1
RD0  (via drill 0.6)
  Top 0.406: v58.17,25.4 58.17,24.13 58.93,23.37 58.93,22.11 IC1.23
  Bottom 0.406: RD0.1 78.74,26.67 77.47,25.4 v58.17,25.4
RD1  (via drill 0.6)
  Top 0.406: v56.9,27.05 56.9,24.13 58.17,22.86 IC1.24
  Bottom 0.406: RD1.1 86.36,29.21 84.58,27.43 78.49,27.43 77.22,26.16 59.18,26.16 58.29,27.05 v56.9,27.05
RESET  (via drill 0.6)
  Top 0.406: 45.72,15.88 51.44,15.88 52.94,17.38 IC1.29 58.06,17.38 58.42,17.02 v58.42,16 | 45.72,15.88 45.72,11.68 46.48,10.92 51.31,10.92 52.07,10.16 C23.1 | ICSP.5 83.06,35.05 83.82,34.29 83.82,29.97 82.8,28.96 v82.8,25.4 | 45.72,15.88 36.63,15.88 RESET.2 RESET.1 28.61,16.23 R1.2
  Bottom 0.406: v58.42,16 77.22,16 77.98,16.76 77.98,24.64 78.99,25.65 82.55,25.65 v82.8,25.4
SCL
  Top 0.305: IC1.28 28.34,18.18 26.67,16.51 24.13,16.51 23.63,17.01 IC5.2
SDA
  Top 0.305: IC5.3 24.13,17.27 24.38,17.02 26.42,17.02 28.38,18.98 IC1.27
SELA
  Top 0.406: IC1.12 82.15,17.38 87,22.23 87,32.38 A.1
SELB
  Top 0.406: IC1.13 81.68,18.18 86.23,22.73 86.23,34.16 B.1
SELC
  Top 0.406: IC1.14 81.21,18.98 85.34,23.11 85.34,35.81 C.1
VCC  (via drill 0.6, 0.6 pad 0.25)
  Top 0.305: IC5.1 21.99,19.48 C3.2
  Top 0.406: R26.2 v62.23,43.18 | 61.91,39.37 R25.2 62.23,39.37 | IC1.20 61.36,17.93 v61.21,17.78 | IC1.4 60.56,17.13 v61.21,17.78 | IC1.6 62.16,17.71 62.23,17.78 | IC1.18 62.96,18 62.74,17.78 62.23,17.78 | ICSP.2 v77.22,32.51 | v61.21,17.78 62.23,17.78 | IC3.3 33.27,39.37 33.02,39.12 v33.02,38.1 33.02,37.34 33.53,36.83 IC3.5 | R1.1 22.1,16.32 v22.1,17.02
  Top 0.813: IC3.14 41.78,41.91 arc45 42,42 v43.18,43.18 | 57.15,31.75 D5.A | D5.A D3.A 57.15,38.11 57.15,39.12 57.4,39.37 61.91,39.37 | 62.23,39.37 v64.77,39.37 | D5.A 57.14,29.2 54.61,26.67 | 54.61,26.67 D7.A 49.52,25.39 49.02,24.89 v34.8,24.89 | 54.61,26.67 54.61,24.38 v56.39,22.61 | C3.2 22.1,19.37 v22.1,17.02 18.73,17.02 | REG1.2 15.84,17.14 | 18.73,17.02 15.96,17.02 15.84,17.14 | 8.38,8.13 C14.+ 6.35,8.38 5.84,8.89 5.84,13.59 9.4,17.14 15.84,17.14 | C16.1 18.73,17.02
  Bottom 0.406: v77.22,32.51 74.17,32.51 IC4.8 | v33.02,38.1 35.56,38.1 36.32,37.34 36.32,25.65 35.56,24.89 v34.8,24.89
  Bottom 0.813: v43.18,43.18 46.36,46.36 58.92,46.36 arc-45 59.15,46.26 v62.23,43.18 62.23,40.13 62.9,39.46 arc45 63.12,39.37 v64.77,39.37 72.39,39.37 | 72.39,39.37 82.42,39.37 arc45 82.64,39.46 85.09,41.91 VCC.1 | v56.39,22.61 56.39,18.8 57.15,18.03 60.96,18.03 v61.21,17.78 | IC4.8 72.39,39.37 | v34.8,24.89 29.97,24.89 v22.1,17.02

### Text on the board
tNames: meta | meta | step | step | main board rev 1 | hotchk155